# Altium schematic sheet Sheet1.SchDoc
size A
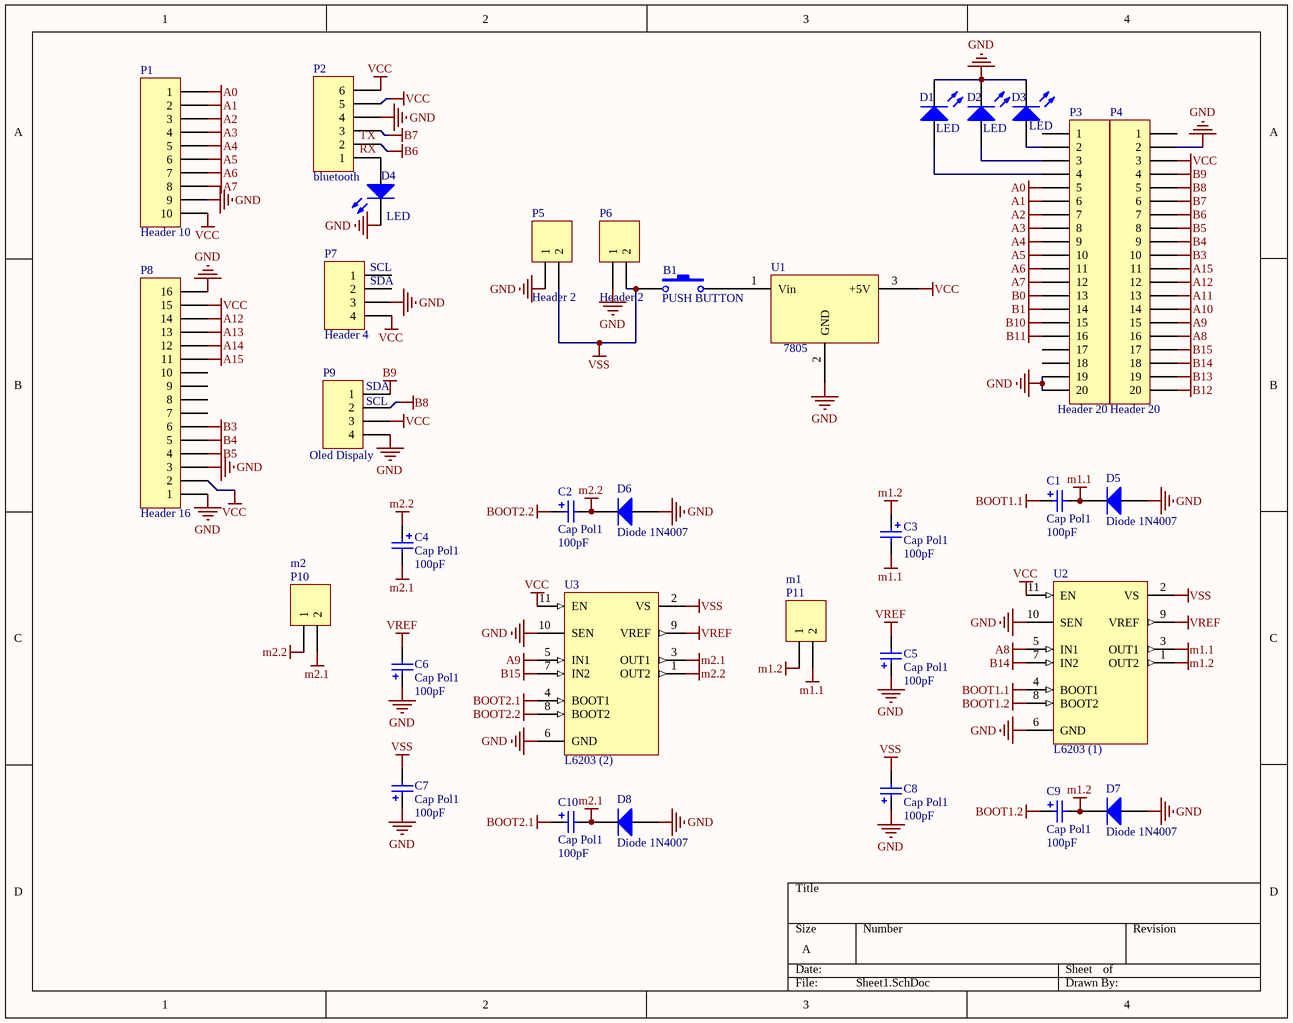
[diagram p0: Sheet1.SchDoc]

## Parts
B1  PUSH BUTTON  [MY_SPST_2]
C1  Cap Pol1  value 100pF  [HDR1X2]
C2  Cap Pol1  value 100pF  [HDR1X2]
C3  Cap Pol1  value 100pF  [HDR1X2]
C4  Cap Pol1  value 100pF  [HDR1X2]
C5  Cap Pol1  value 100pF  [HDR1X2]
C6  Cap Pol1  value 100pF  [HDR1X2]
C7  Cap Pol1  value 100pF  [HDR1X2]
C8  Cap Pol1  value 100pF  [HDR1X2]
C9  Cap Pol1  value 100pF  [HDR1X2]
C10  Cap Pol1  value 100pF  [HDR1X2]
D1  LED  [My_LED3MM]
D2  LED  [My_LED3MM]
D3  LED  [My_LED3MM]
D4  LED  [My_LED3MM]
D5  Diode 1N4007  [DO-41]
D6  Diode 1N4007  [DO-41]
D7  Diode 1N4007  [DO-41]
D8  Diode 1N4007  [DO-41]
P1  Header 10  [HDR1X10]
P2  bluetooth  [HDR1X6]
P3  Header 20  [HDR1X20]
P4  Header 20  [HDR1X20]
P5  Header 2  [HDR1X2]
P6  Header 2  [HDR1X2]
P7  Header 4  [HDR1X4]
P8  Header 16  [HDR1X16]
P9  Oled Dispaly  [HDR1X4]
P10  m2  [HDR1X2]
P11  m1  [HDR1X2]
U1  7805  [My_TO-220]
U2  L6203 (1)  [Multiwatt11]
U3  L6203 (2)  [Multiwatt11]

## Nets
A0: P1.1 P3.5
A1: P1.2 P3.6
A2: P1.3 P3.7
A3: P1.4 P3.8
A4: P1.5 P3.9
A5: P1.6 P3.10
A6: P1.7 P3.11
A7: P1.8 P3.12
A8: P4.16 U2.5(IN1)
A9: P4.15 U3.5(IN1)
A10: P4.14
A11: P4.13
A12: P4.12 P8.14
A13: P8.13
A14: P8.12
A15: P4.11 P8.11
B0: P3.13
B1: P3.14
B3: P4.10 P8.6
B4: P4.9 P8.5
B5: P4.8 P8.4
B6: P2.2 P4.7
B7: P2.3 P4.6
B8: P4.5 P9.2
B9: P4.4 P9.1
B10: P3.15
B11: P3.16
B12: P4.20
B13: P4.19
B14: P4.18 U2.7(IN2)
B15: P4.17 U3.7(IN2)
BOOT1.1: C1.1 U2.4(BOOT1)
BOOT1.2: C9.1 U2.8(BOOT2)
BOOT2.1: C10.1 U3.4(BOOT1)
BOOT2.2: C2.1 U3.8(BOOT2)
GND: C5.1 C6.1 C7.1 C8.1 D1.K D2.K D3.K D4.K D5.1(A) D6.1(A) D7.1(A) D8.1(A) P1.9 P2.4 P3.19 P3.20 P4.2 P5.1 P6.1 P8.1 P8.3 P8.16 P9.4 U1.2(GND) U2.6(GND) U2.10(SEN) U3.6(GND) U3.10(SEN)
m1.1: C1.2 C3.2 D5.2(K) P11.2 U2.3(OUT1)
m1.2: C3.1 C9.2 D7.2(K) P11.1 U2.1(OUT2)
m2.1: C4.2 C10.2 D8.2(K) P10.2 U3.3(OUT1)
m2.2: C2.2 C4.1 D6.2(K) P10.1 U3.1(OUT2)
VCC: P1.10 P2.5 P2.6 P4.3 P7.4 P8.2 P8.15 P9.3 U1.3(+5V) U2.11(EN) U3.11(EN)
VREF: C5.2 C6.2 U2.9(VREF) U3.9(VREF)
VSS: B1.1 C7.2 C8.2 P5.2 P6.2 U2.2(VS) U3.2(VS)
NetB1_2: B1.2 U1.1(Vin)
NetD1_A: D1.A P3.4
NetD2_A: D2.A P3.3
NetD3_A: D3.A P3.2
NetD4_A: D4.A P2.1

Not connected (* = marked no-connect by the designer): P3 1 17 18; P4 1; P7 1 2 3; P8 7 8 9 10

## Notes on the sheet
- (near P2) RX
- (near P2) TX
- (near P7) SCL
- (near P7) SDA
- (near P9) SDA
- (near P9) SCL
- Labels drawn without touching a wire or pin: GND

## Library data of the parts
C1-C10 = Cap Pol1: Polarized Capacitor (Radial); Published: 8-Jun-2000; LatestRevisionDate: 17-Jul-2002; LatestRevisionNote: Re-released for DXP Platform.; PackageReference: RB7.6-15; Publisher: Altium Limited
D1-D4 = LED: Typical INFRARED GaAs LED; Published: 8-Jun-2000; LatestRevisionDate: 08-Jul-2005; LatestRevisionNote: Mech Layer 1 removed.; Publisher: Altium Limited
D5-D8 = Diode 1N4007: 1 Amp General Purpose Rectifier; Published: 8-Jun-2000; LatestRevisionDate: 17-Jul-2002; LatestRevisionNote: Re-released for DXP Platform.; DatasheetDocument: 1998; PackageDocument: Aug-1999; PackageReference: DO-41; Publisher: Altium Limited; Code_JEDEC: DO-204-AL; ComponentLink1Description: Manufacturer Link; ComponentLink1URL: http://www.fairchildsemi.com/; ComponentLink2Description: Datasheet; ComponentLink2URL: http://www.fairchildsemi.com/ds/1N%2F1N4001.pdf
P1 = Header 10: Header, 10-Pin; LatestRevisionDate: 17-Jul-2002; LatestRevisionNote: Re-released for DXP Platform.; Publisher: Altium Limited
P2 = Header 6: Header, 6-Pin; LatestRevisionDate: 17-Jul-2002; LatestRevisionNote: Re-released for DXP Platform.; Publisher: Altium Limited
P3 P4 = Header 20: Header, 20-Pin; LatestRevisionDate: 17-Jul-2002; LatestRevisionNote: Re-released for DXP Platform.; Publisher: Altium Limited
P5 P6 P10 P11 = Header 2: Header, 2-Pin; LatestRevisionDate: 17-Jul-2002; LatestRevisionNote: Re-released for DXP Platform.; Publisher: Altium Limited
P7 P9 = Header 4: Header, 4-Pin; LatestRevisionDate: 17-Jul-2002; LatestRevisionNote: Re-released for DXP Platform.; Publisher: Altium Limited
P8 = Header 16: Header, 16-Pin; LatestRevisionDate: 17-Jul-2002; LatestRevisionNote: Re-released for DXP Platform.; Publisher: Altium Limited
U1 = 7805: Regulator
U2 U3 = L6203: DMOS Full Bridge Driver; Note: TAB connected to pin 6; Published: 8-Jun-2000; LatestRevisionDate: 17-Jul-2002; LatestRevisionNote: Re-released for DXP Platform.; DatasheetVersion: Jul-1997; PackageReference: Multiwatt11; Publisher: Altium Limited; PackageDescription: TO, Thru-Hole, Vertical, Heatsink Mounted; 11 Bent Staggered Leads; Pitch 1.7 mm; ComponentLink1Description: Manufacturer Link; ComponentLink1URL: http://www.st.com/; ComponentLink2Description: Datasheet; ComponentLink2URL: http://www.st.com/stonline/products/literature/ds/1373/l6201.pdf